# Altium schematic sheet [10] - COMMUNICATION.SchDoc: Test title
size A4; Projectnumber: OWN-000; Date: YYYY-MM-DD; Engineer: X; SheetNumber: 10; Size: A4
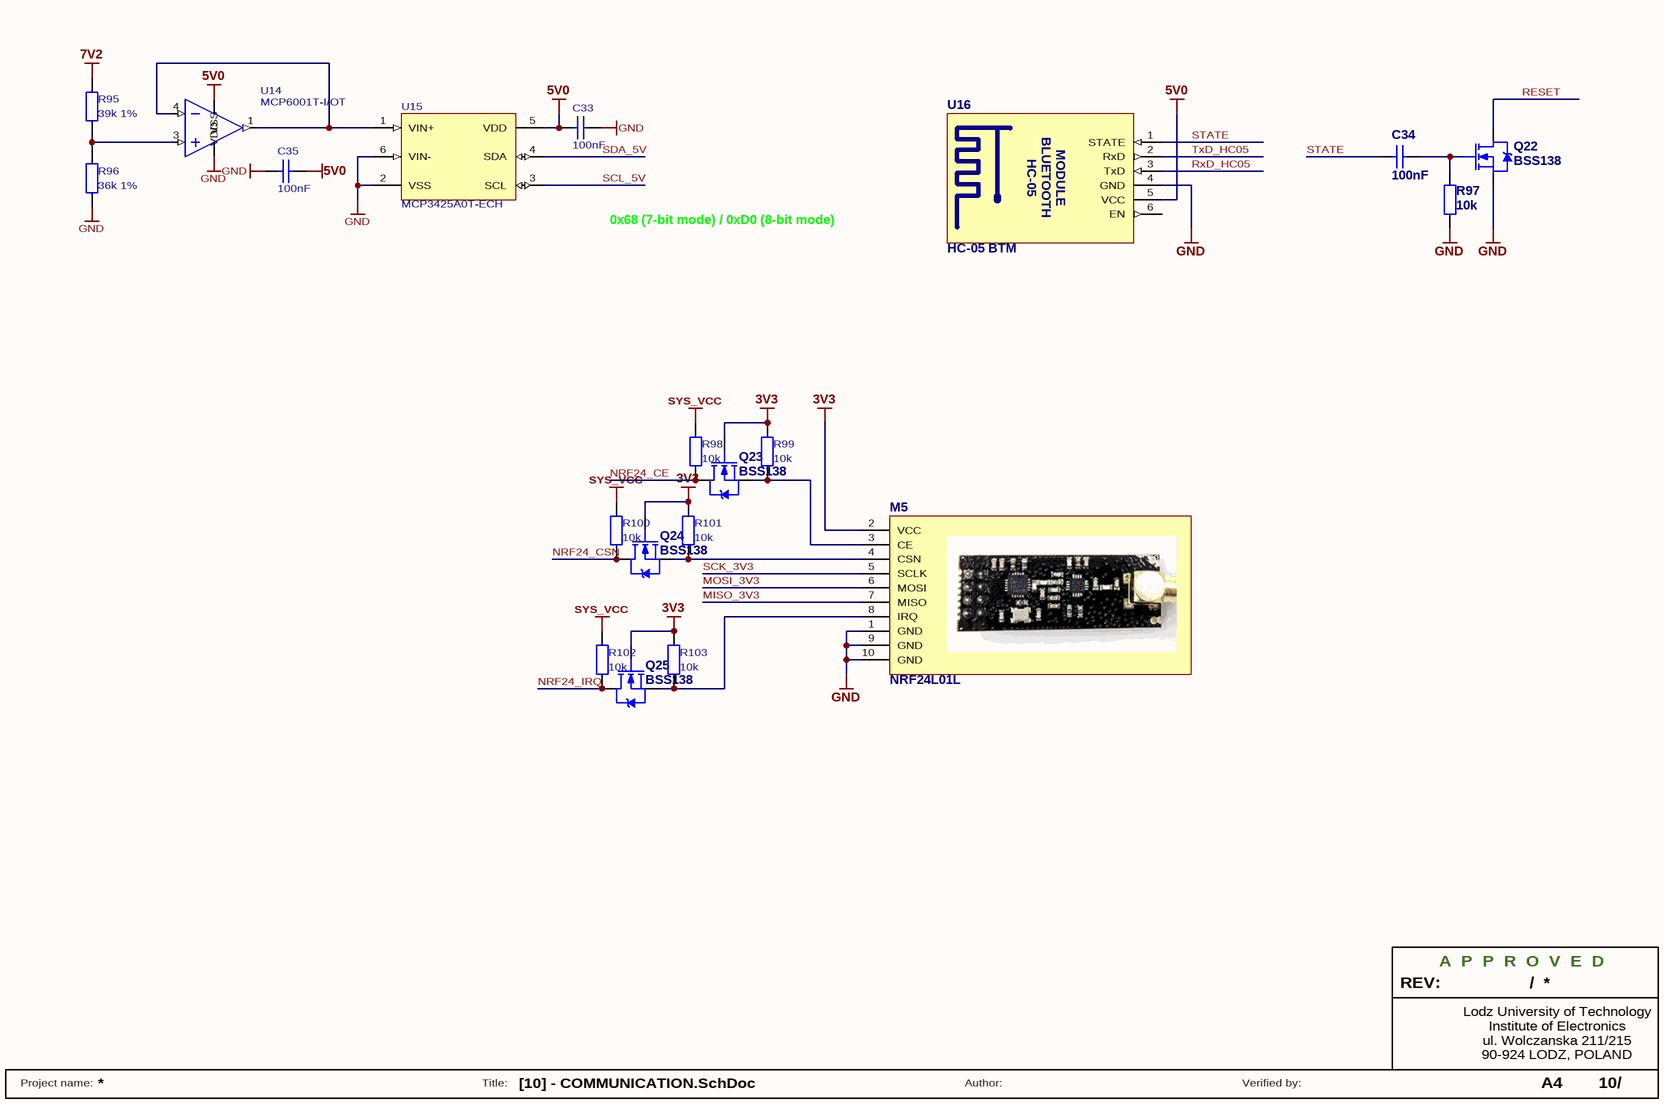
[diagram p0: [10] - COMMUNICATION.SchDoc]

## Parts
C33  100nF  [C0805]
C34  100nF  [C0805]
C35  100nF  [C0805]
M5  NRF24L01L  [NRF24L01L]
Q22  BSS138  [SOT-23]
Q23  BSS138  [SOT-23]
Q24  BSS138  [SOT-23]
Q25  BSS138  [SOT-23]
R95  39k 1%  [R0805]
R96  36k 1%  [R0805]
R97  10k  [R0805]
R98  10k  [R0805]
R99  10k  [R0805]
R100  10k  [R0805]
R101  10k  [R0805]
R102  10k  [R0805]
R103  10k  [R0805]
U14  MCP6001T-I/OT  [SOT-23-5]
U15  MCP3425A0T-ECH  [SOT-23-6]
U16  HC-05 BTM  [HC-05_H_2]

## Nets
3V3: M5.2(VCC) Q23.1(G) Q24.1(G) Q25.1(G) R99.1 R101.1 R103.1
5V0: C33.1 C35.1 U14.5(VDD) U15.5(VDD) U16.5(VCC)
7V2: R95.1
GND: C33.2 C35.2 M5.1(GND) M5.9(GND) M5.10(GND) Q22.2(S) R96.2 R97.2 U14.2(VSS) U15.2(VSS) U15.6(VIN-) U16.4(GND)
SYS_VCC: R98.1 R100.1 R102.1
MISO_3V3: M5.7(MISO)
MOSI_3V3: M5.6(MOSI)
NRF24_CE: Q23.3(D) R98.2
NRF24_CSN: Q24.3(D) R100.2
NRF24_IRQ: Q25.3(D) R102.2
RESET: Q22.3(D)
RxD_HC05: U16.3(TxD)
SCK_3V3: M5.5(SCLK)
SCL_5V: U15.3(SCL)
SDA_5V: U15.4(SDA)
STATE: C34.1 U16.1(STATE)
TxD_HC05: U16.2(RxD)
NetC34_2: C34.2 Q22.1(G) R97.1
NetM5_3: M5.3(CE) Q23.2(S) R99.2
NetM5_4: M5.4(CSN) Q24.2(S) R101.2
NetM5_8: M5.8(IRQ) Q25.2(S) R103.2
NetR95_2: R95.2 R96.1 U14.3(IN+)
NetU14_1: U14.1(OUT) U14.4(IN-) U15.1(VIN+)

Not connected (* = marked no-connect by the designer): U16 6(EN)

## Notes on the sheet
- (near U15) 0x68 (7-bit mode) / 0xD0 (8-bit mode)
- REV:
- A  P  P  R  O  V  E  D
- /
- Lodz University of Technology
- ul. Wolczanska 211/215
- 90-924 LODZ, POLAND
- Institute of Electronics
- Project name:
- Title:
- Author:
- Verified by:
- (in symbol HC-05_BTM) HC-05; BLUETOOTH; MODULE

## Library data of the parts
C33-C35 = Cap: Capacitor; ComponentLink1Description: datasheet; ComponentLink2Description: supplier; Value: 100nF
M5 = NRF24L01L: Long Range Wireless Module R2 (1.1KM, PA+SMA)
Q22-Q25 = BSS138: N-Channel Enhancement Mode Vertical DMOS FET; Published: 17-Dec-2003; DatasheetVersion: Mar-96; PackageVersion: 1996; PackageReference: SOT23; Publisher: Altium Limited; PackageDescription: SOT-23; 3 Leads; Body 3.1 x 2.5 mm, inc. leads (LxW max), Alternate Lead Configuration; ComponentLink1Description: Manufacturer Link; ComponentLink1URL: http://www.zetex.com/; ComponentLink2Description: Datasheet; ComponentLink2URL: www.zetex.com/3.0/pdf/BSS138.pdf
R95-R103 = Res: Resistor; Published: 19-Feb-2006; ComponentLink1Description: datasheet; ComponentLink2Description: supplier
  R95: Value: 39k 1%
  R96: Value: 36k 1%
  R97-R103: Value: 10k
U14 = MCP6001T-I/OT: Rail-to-rail, 1MHz, 100uA Op Amp; Supplier 1: Farnell; Supplier 2: TME; Supplier Part Number 1: 1825040; Supplier Part Number 2: MCP6401T-E/OT
U15 = MCP3425A0T-ECH: 16-Bit Analog-to-Digital Converter with I2C Interface and On-Board Reference; Supplier 1: Farnell; Supplier 2: Farnell; Supplier 3: Farnell; Supplier 4: TME; Supplier Part Number 1: 1578433; Supplier Part Number 2: 2371380; Supplier Part Number 3: 1578433RL; Supplier Part Number 4: MCP3425A0T-ECH
U16 = HC-05_BTM: HC-05 Bluetooth Module